# EAGLE design amelia_B_v1 (EAGLE 9.6.2)

## Sheet 1 of 3: Power
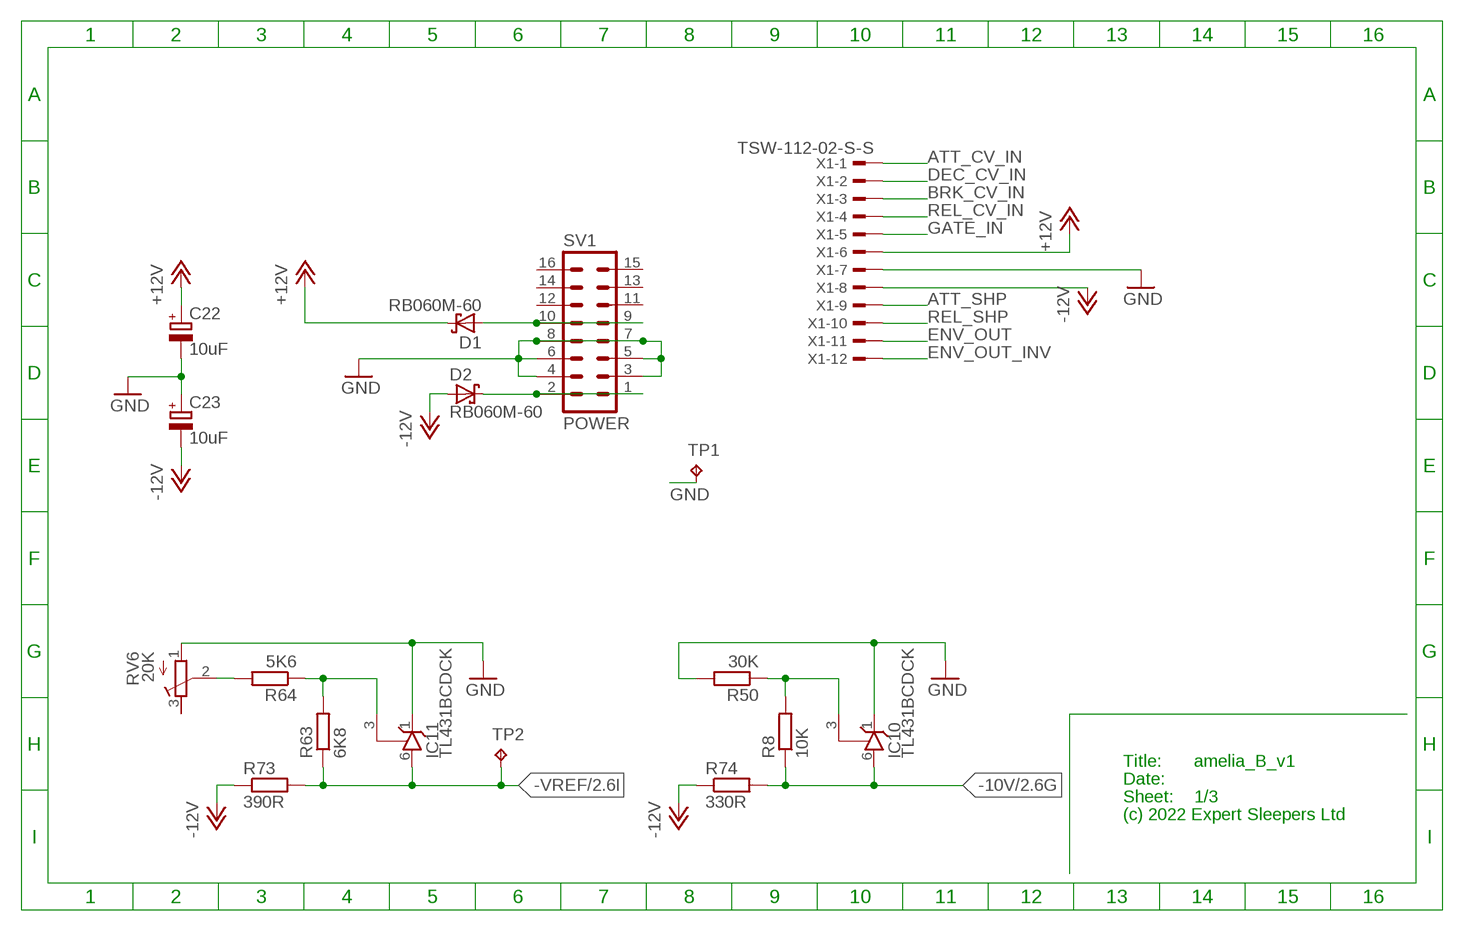
[diagram p0: schematic, sheet 1]

### Parts
C22  10uF  CPOL-EUUD-4X5,8  [UD-4X5,8_NICHICON]
C23  10uF  CPOL-EUUD-4X5,8  [UD-4X5,8_NICHICON]
D1  RB060M-60  [SOD123FL]
D2  RB060M-60  [SOD123FL]
IC10  TL431BCDCK  [DCK_SC-70]
IC11  TL431BCDCK  [DCK_SC-70]
R8  10K  R-EU_R0603  [R0603]
R50  30K  R-EU_R0603  [R0603]
R63  6K8  R-EU_R0603  [R0603]
R64  5K6  R-EU_R0603  [R0603]
R73  390R  R-EU_R1206  [R1206]
R74  330R  R-EU_R1206  [R1206]
RV6  20K  TC33X  [TC33X]
SV1  POWER  ML16  [ML16]
TP1  RA2  TPPAD1-13  [P1-13]
TP2  RA2  TPPAD1-13  [P1-13]
X1  TSW-112-02-S-S  [TSW-112-02-S-S]

### Nets
+12V: C22.+ D1.C X1.6 ; also sheet 2,3
-10V [power]: IC10.6(A) R8.1 R74.2 ; also sheet 2
-12V: C23.- D2.A R73.1 R74.1 X1.8 ; also sheet 2
-VREF: IC11.6(A) R63.1 R73.2 TP2.TP ; also sheet 2
ATT_CV_IN: X1.1 ; also sheet 2
ATT_SHP: X1.9 ; also sheet 2
BRK_CV_IN: X1.3 ; also sheet 2
DEC_CV_IN: X1.2 ; also sheet 2
ENV_OUT: X1.11 ; also sheet 2
ENV_OUT_INV: X1.12 ; also sheet 2
GATE_IN: X1.5 ; also sheet 3
GND [power]: C22.- C23.+ IC10.1(C) IC11.1(C) R50.2 RV6.1(A) SV1.3 SV1.4 SV1.5 SV1.6 SV1.7 SV1.8 TP1.TP X1.7 ; also sheet 2,3
N$1: D2.C SV1.1 SV1.2
N$15: D1.A SV1.9 SV1.10
N$20: IC11.3(R) R63.2 R64.1
N$21: R64.2 RV6.2(S)
N$28 [power]: IC10.3(R) R8.2 R50.1
REL_CV_IN: X1.4 ; also sheet 2
REL_SHP: X1.10 ; also sheet 2
Unconnected: RV6.3(E) SV1.11 SV1.12 SV1.13 SV1.14 SV1.15 SV1.16

### Notes on the sheet
- Title:
- Date:
- Sheet:
- (c) 2022 Expert Sleepers Ltd

## Sheet 2 of 3: CV processing and integrator
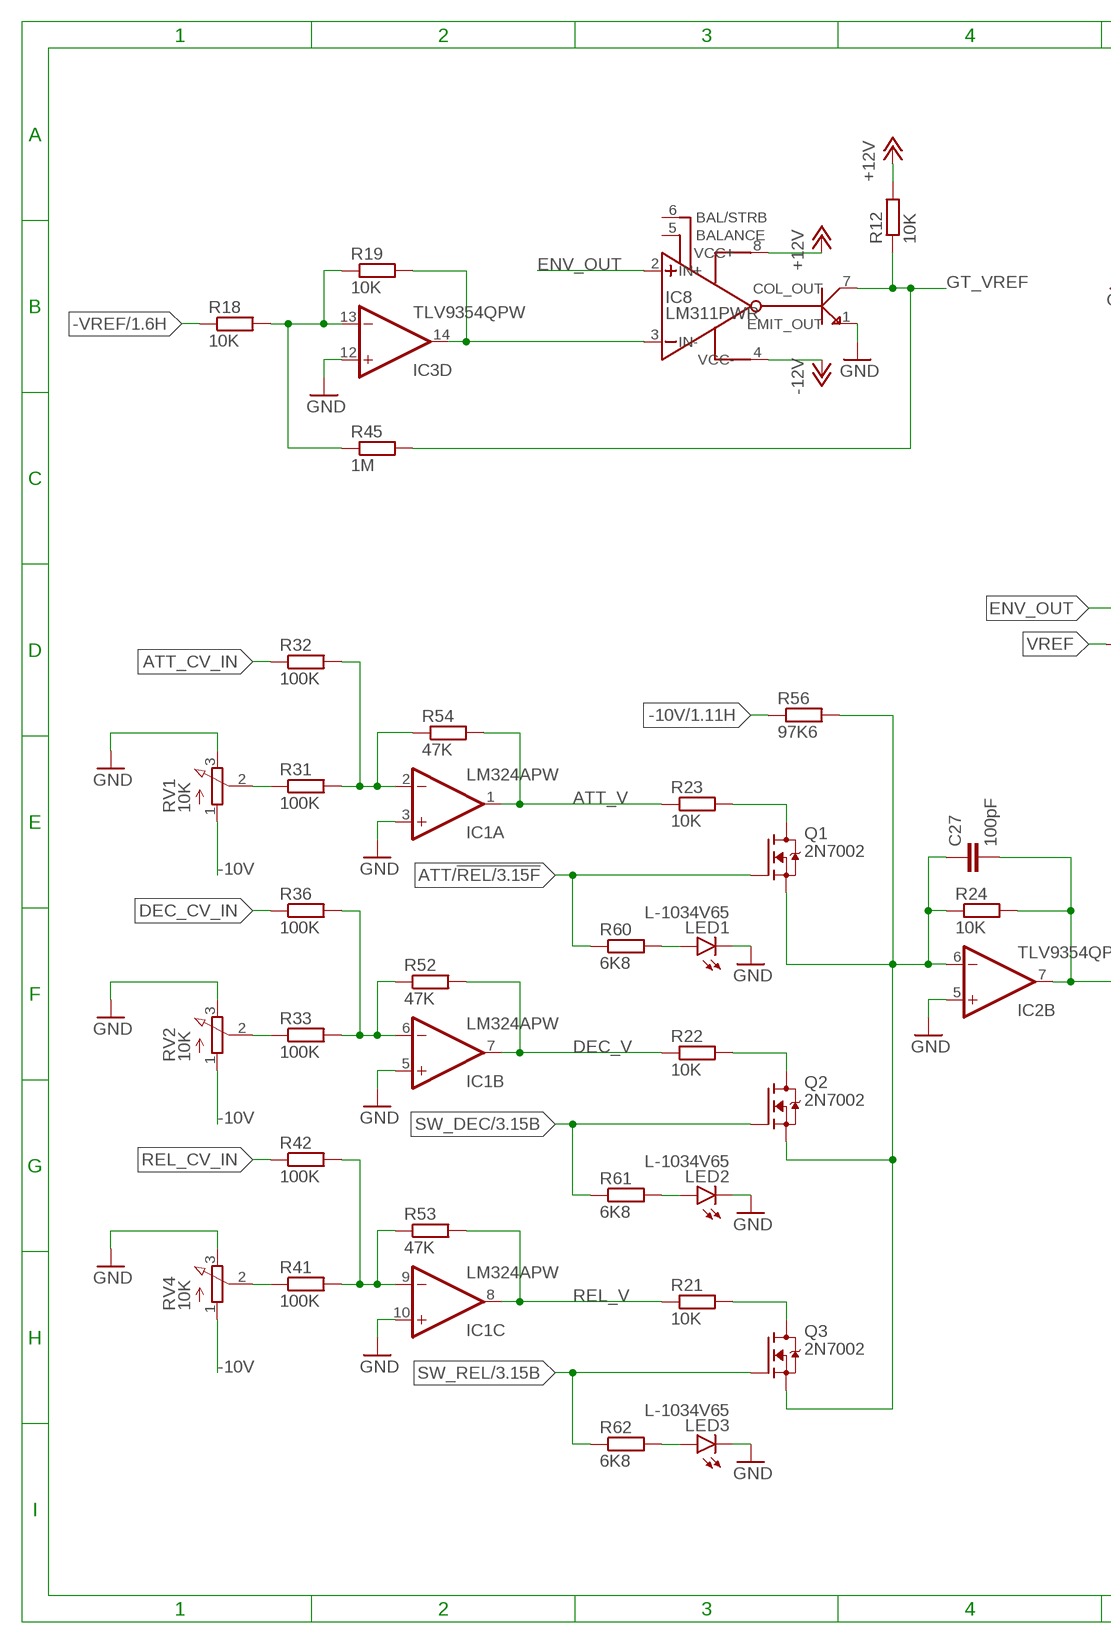
[diagram p1: schematic, sheet 2, part 1 of 2]
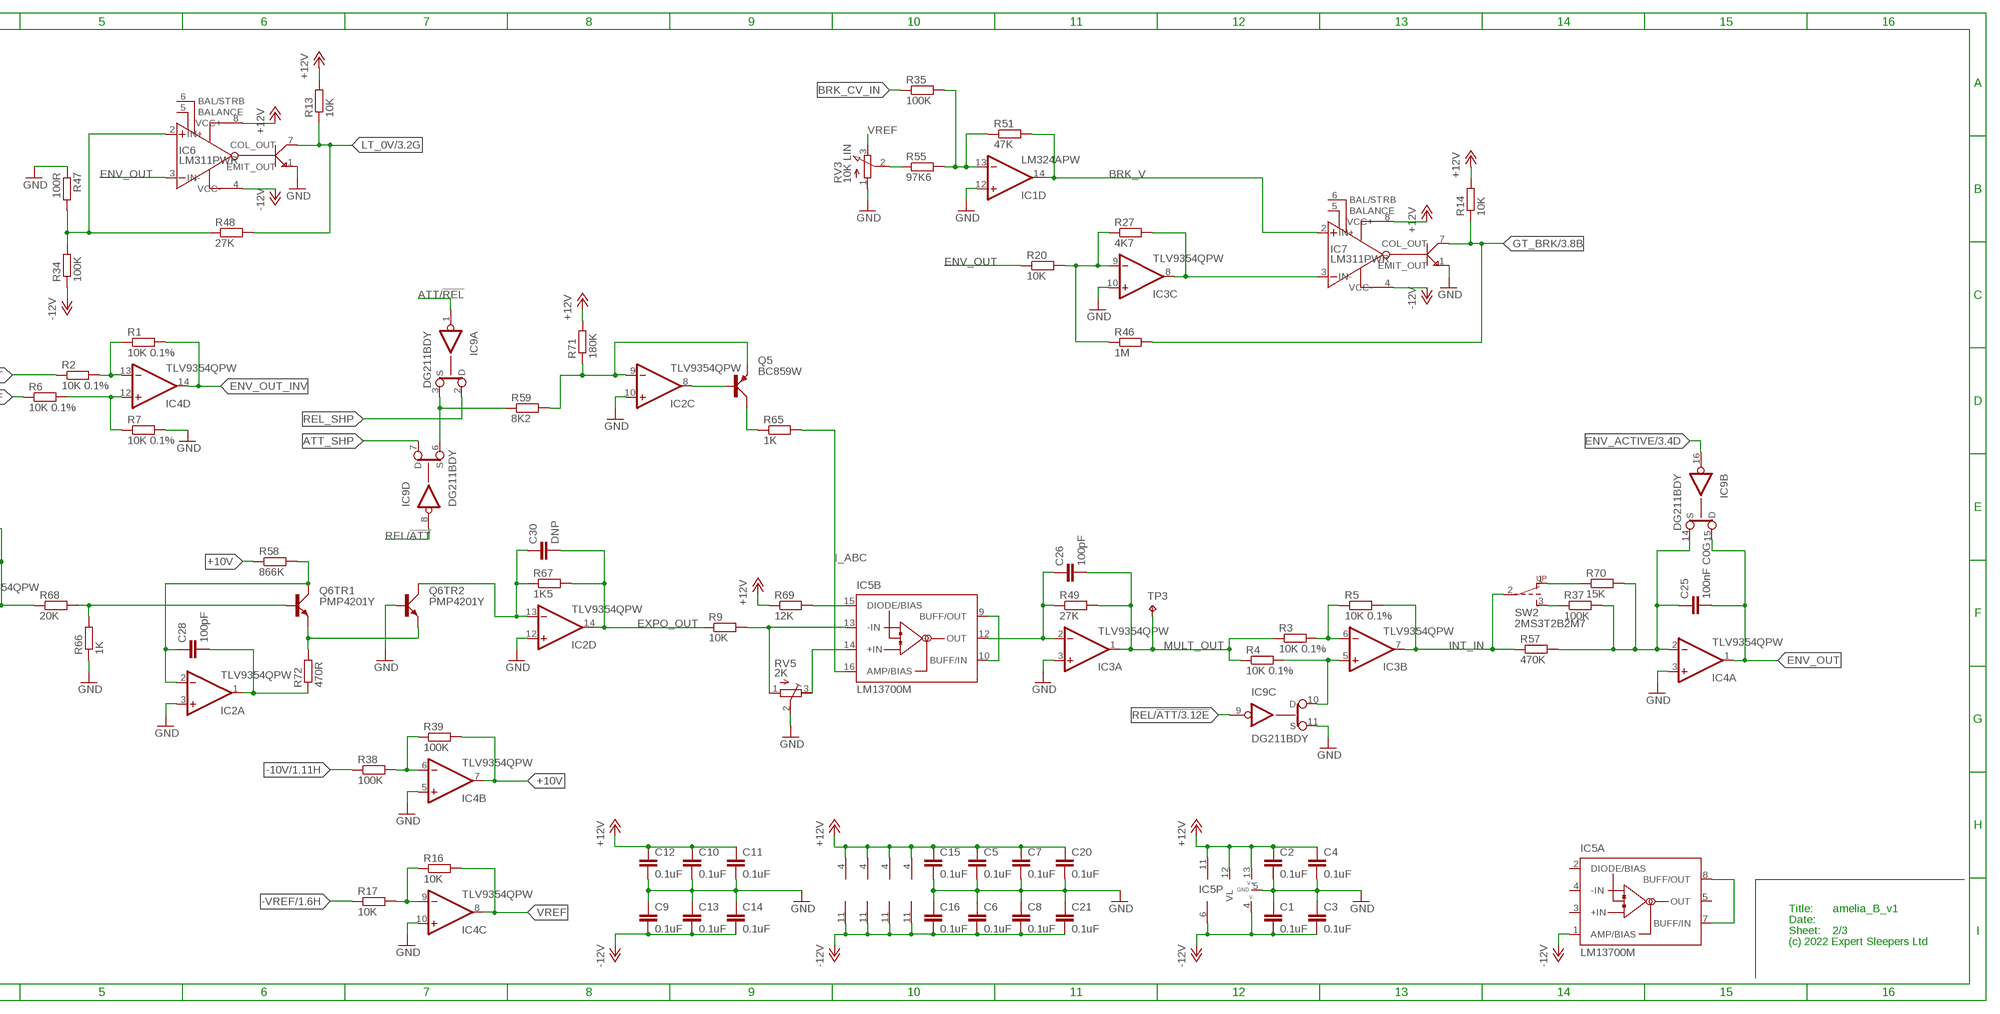
[diagram p2: schematic, sheet 2, part 2 of 2]

### Parts
C1  0.1uF  C-EUC0402  [C0402]
C2  0.1uF  C-EUC0402  [C0402]
C3  0.1uF  C-EUC0402  [C0402]
C4  0.1uF  C-EUC0402  [C0402]
C5  0.1uF  C-EUC0402  [C0402]
C6  0.1uF  C-EUC0402  [C0402]
C7  0.1uF  C-EUC0402  [C0402]
C8  0.1uF  C-EUC0402  [C0402]
C9  0.1uF  C-EUC0402  [C0402]
C10  0.1uF  C-EUC0402  [C0402]
C11  0.1uF  C-EUC0402  [C0402]
C12  0.1uF  C-EUC0402  [C0402]
C13  0.1uF  C-EUC0402  [C0402]
C14  0.1uF  C-EUC0402  [C0402]
C15  0.1uF  C-EUC0402  [C0402]
C16  0.1uF  C-EUC0402  [C0402]
C20  0.1uF  C-EUC0402  [C0402]
C21  0.1uF  C-EUC0402  [C0402]
C25  100nF C0G  C-EUC1206  [C1206]
C26  100pF  C-EUC0603  [C0603]
C27  100pF  C-EUC0603  [C0603]
C28  100pF  C-EUC0603  [C0603]
C30  DNP  C-EUC0603  [C0603]
IC1  LM324APW  TL074PW  [PW_R-PDSO-G14]
IC2  TLV9354QPW  TL074PW  [PW_R-PDSO-G14]
IC3  TLV9354QPW  TL074PW  [PW_R-PDSO-G14]
IC4  TLV9354QPW  TL074PW  [PW_R-PDSO-G14]
IC5  LM13700M  [SO16]
IC6  LM311PWR  [SOP65P640X120-8N]
IC7  LM311PWR  [SOP65P640X120-8N]
IC8  LM311PWR  [SOP65P640X120-8N]
IC9  DG211BDY  DG211CJD  [SO16]
LED1  L-1034V65  [L-1034_V6.5MM]
LED2  L-1034V65  [L-1034_V6.5MM]
LED3  L-1034V65  [L-1034_V6.5MM]
Q1  2N7002  [SOT23]
Q2  2N7002  [SOT23]
Q3  2N7002  [SOT23]
Q5  BC859W  [SOT323]
Q6  PMP4201Y  [SOT65P210X110-6N]
R1  10K 0.1%  R-EU_R0603  [R0603]
R2  10K 0.1%  R-EU_R0603  [R0603]
R3  10K 0.1%  R-EU_R0603  [R0603]
R4  10K 0.1%  R-EU_R0603  [R0603]
R5  10K 0.1%  R-EU_R0603  [R0603]
R6  10K 0.1%  R-EU_R0603  [R0603]
R7  10K 0.1%  R-EU_R0603  [R0603]
R9  10K  R-EU_R0603  [R0603]
R12  10K  R-EU_R0603  [R0603]
R13  10K  R-EU_R0603  [R0603]
R14  10K  R-EU_R0603  [R0603]
R16  10K  R-EU_R0603  [R0603]
R17  10K  R-EU_R0603  [R0603]
R18  10K  R-EU_R0603  [R0603]
R19  10K  R-EU_R0603  [R0603]
R20  10K  R-EU_R0603  [R0603]
R21  10K  R-EU_R0603  [R0603]
R22  10K  R-EU_R0603  [R0603]
R23  10K  R-EU_R0603  [R0603]
R24  10K  R-EU_R0603  [R0603]
R27  4K7  R-EU_R0603  [R0603]
R31  100K  R-EU_R0603  [R0603]
R32  100K  R-EU_R0603  [R0603]
R33  100K  R-EU_R0603  [R0603]
R34  100K  R-EU_R0603  [R0603]
R35  100K  R-EU_R0603  [R0603]
R36  100K  R-EU_R0603  [R0603]
R37  100K  R-EU_R0603  [R0603]
R38  100K  R-EU_R0603  [R0603]
R39  100K  R-EU_R0603  [R0603]
R41  100K  R-EU_R0603  [R0603]
R42  100K  R-EU_R0603  [R0603]
R45  1M  R-EU_R0603  [R0603]
R46  1M  R-EU_R0603  [R0603]
R47  100R  R-EU_R0603  [R0603]
R48  27K  R-EU_R0603  [R0603]
R49  27K  R-EU_R0603  [R0603]
R51  47K  R-EU_R0603  [R0603]
R52  47K  R-EU_R0603  [R0603]
R53  47K  R-EU_R0603  [R0603]
R54  47K  R-EU_R0603  [R0603]
R55  97K6  R-EU_R0603  [R0603]
R56  97K6  R-EU_R0603  [R0603]
R57  470K  R-EU_R0603  [R0603]
R58  866K  R-EU_R0603  [R0603]
R59  8K2  R-EU_R0603  [R0603]
R60  6K8  R-EU_R0603  [R0603]
R61  6K8  R-EU_R0603  [R0603]
R62  6K8  R-EU_R0603  [R0603]
R65  1K  R-EU_R0603  [R0603]
R66  1K  R-EU_R0603  [R0603]
R67  1K5  R-EU_R0603  [R0603]
R68  20K  R-EU_R0603  [R0603]
R69  12K  R-EU_R0603  [R0603]
R70  15K  R-EU_R0603  [R0603]
R71  180K  R-EU_R0603  [R0603]
R72  470R  R-EU_R0603  [R0603]
RV1  10K  RD1610NOA0X  [RD1610NOA0X]
RV2  10K  RD1610NOA0X  [RD1610NOA0X]
RV3  10K LIN  RD1610NOA0X  [RD1610NOA0X]
RV4  10K  RD1610NOA0X  [RD1610NOA0X]
RV5  2K  T93YA  [RTRIM3296W]
SW2  2MS3T2B2M7  [2MS1T2B2M7RE]
TP3  RA2  TPPAD1-13  [P1-13]

### Nets
+10V: IC4.7(B:OUT) R39.2 R58.1
+12V: C2.1 C4.1 C5.1 C7.1 C10.1 C11.1 C12.1 C15.1 C20.1 IC1.4(P:V+) IC2.4(P:V+) IC3.4(P:V+) IC4.4(P:V+) IC5.11(P:V+) IC6.8(VCC+) IC7.8(VCC+) IC8.8(VCC+) IC9.12(VL:VL) IC9.13(P:V+) R12.2 R13.2 R14.2 R69.1 R71.2 ; also sheet 1,3
-10V [power]: R38.1 R56.1 RV1.1(A) RV2.1(A) RV4.1(A) ; also sheet 1
-12V: C1.2 C3.2 C6.2 C8.2 C9.2 C13.2 C14.2 C16.2 C21.2 IC1.11(P:V-) IC2.11(P:V-) IC3.11(P:V-) IC4.11(P:V-) IC5.1(A:AMP/BIAS) IC5.6(P:V-) IC6.4(VCC-) IC7.4(VCC-) IC8.4(VCC-) IC9.4(P:V-) R34.1 ; also sheet 1
-VREF: R17.1 R18.1 ; also sheet 1
ATT/!REL: IC9.1(A:IN) Q1.1(G) R60.1 ; also sheet 3
ATT_CV_IN: R32.1 ; also sheet 1
ATT_SHP: IC9.7(D:D) ; also sheet 1
ATT_V: IC1.1(A:OUT) R23.1 R54.2
BRK_CV_IN: R35.1 ; also sheet 1
BRK_V: IC1.14(D:OUT) IC7.2(IN+) R51.2
DEC_CV_IN: R36.1 ; also sheet 1
DEC_V: IC1.7(B:OUT) R22.1 R52.2
ENV_ACTIVE: IC9.16(B:IN) ; also sheet 3
ENV_OUT: C25.2 IC4.1(A:OUT) IC6.3(IN-) IC8.2(IN+) IC9.15(B:D) R2.1 R20.1 ; also sheet 1
ENV_OUT_INV: IC4.14(D:OUT) R1.2 ; also sheet 1
EXPO_OUT: C30.2 IC2.14(D:OUT) R9.1 R67.2
GND [power]: C1.1 C2.2 C3.1 C4.2 C5.2 C6.1 C7.2 C8.1 C9.1 C10.2 C11.2 C12.2 C13.1 C14.1 C15.2 C16.1 C20.2 C21.1 IC1.3(A:+IN) IC1.5(B:+IN) IC1.10(C:+IN) IC1.12(D:+IN) IC2.3(A:+IN) IC2.5(B:+IN) IC2.10(C:+IN) IC2.12(D:+IN) IC3.3(A:+IN) IC3.10(C:+IN) IC3.12(D:+IN) IC4.3(A:+IN) IC4.5(B:+IN) IC4.10(C:+IN) IC6.1(EMIT_OUT) IC7.1(EMIT_OUT) IC8.1(EMIT_OUT) IC9.5(P:GND) IC9.11(C:S) LED1.K(C) LED2.K(C) LED3.K(C) Q6.2(TR2:B) R7.2 R47.1 R66.1 RV1.3(E) RV2.3(E) RV3.1(A) RV4.3(E) RV5.2(S) ; also sheet 1,3
GT_BRK: IC7.7(COL_OUT) R14.1 R46.2 ; also sheet 3
GT_VREF: IC8.7(COL_OUT) R12.1 R45.2 ; also sheet 3
I_ABC: IC5.16(B:AMP/BIAS) R65.2
INT_IN: IC3.7(B:OUT) R5.2 R57.1 SW2.2(PR)
LT_0V: IC6.7(COL_OUT) R13.1 R48.2 ; also sheet 3
MULT_OUT: C26.2 IC3.1(A:OUT) R3.1 R4.1 R49.2 TP3.TP
N$2: IC4.13(D:-IN) R1.1 R2.2
N$9: C30.1 IC2.13(D:-IN) Q6.3(TR2:C) R67.1
N$10: C26.1 IC3.2(A:-IN) IC5.12(B:OUT) R49.1
N$12: IC5.15(B:DIODE/BIAS) R69.2
N$13: IC3.6(B:-IN) R3.2 R5.1
N$14: IC5.13(B:-IN) R9.2 RV5.1(A)
N$16: IC5.7(A:BUFF/IN) IC5.8(A:BUFF/OUT)
N$23: IC3.13(D:-IN) R18.2 R19.1 R45.1
N$24: IC3.14(D:OUT) IC8.3(IN-) R19.2
N$26: R41.1 RV4.2(S)
N$32: IC1.9(C:-IN) R41.2 R42.2 R53.1
N$33: Q1.3(D) R23.2
N$34: C27.2 IC2.7(B:OUT) R24.2 R68.1
N$35: R55.1 RV3.2(S)
N$37: IC4.9(C:-IN) R16.1 R17.2
N$41: IC4.12(D:+IN) R6.2 R7.1
N$42: IC3.9(C:-IN) R20.2 R27.1 R46.1
N$43: IC6.2(IN+) R34.2 R47.2 R48.1
N$44: IC3.8(C:OUT) IC7.3(IN-) R27.2
N$45: C25.1 IC4.2(A:-IN) IC9.14(B:S) R37.2 R57.2 R70.2
N$46: IC2.8(C:OUT) Q5.1(B)
N$48: IC3.5(B:+IN) IC9.10(C:D) R4.2
N$49: R31.1 RV1.2(S)
N$50: Q2.3(D) R22.2
N$51: IC1.13(D:-IN) R35.2 R51.1 R55.2
N$52: Q3.3(D) R21.2
N$53: C27.1 IC2.6(B:-IN) Q1.2(S) Q2.2(S) Q3.2(S) R24.1 R56.2
N$54: Q6.1(TR1:B) R66.2 R68.2
N$55: IC5.14(B:+IN) RV5.3(E)
N$56: IC1.2(A:-IN) R31.2 R32.2 R54.1
N$57: R33.1 RV2.2(S)
N$58: IC1.6(B:-IN) R33.2 R36.2 R52.1
N$59: R37.1 SW2.3(RD)
N$60: C28.1 IC2.2(A:-IN) Q6.6(TR1:C) R58.2
N$61: C28.2 IC2.1(A:OUT) R72.1
N$62: IC2.9(C:-IN) Q5.2(E) R59.2 R71.1
N$63: R70.1 SW2.1(RU)
N$64: Q6.4(TR2:E) Q6.5(TR1:E) R72.2
N$69: IC4.6(B:-IN) R38.2 R39.1
N$73: LED1.A R60.2
N$75: LED2.A R61.2
N$78: LED3.A R62.2
N$79: Q5.3(C) R65.1
N$80: IC9.3(A:S) IC9.6(D:S) R59.1
N$83: IC5.9(B:BUFF/OUT) IC5.10(B:BUFF/IN)
REL/!ATT: IC9.8(D:IN) IC9.9(C:IN) ; also sheet 3
REL_CV_IN: R42.1 ; also sheet 1
REL_SHP: IC9.2(A:D) ; also sheet 1
REL_V: IC1.8(C:OUT) R21.1 R53.2
SW_DEC: Q2.1(G) R61.1 ; also sheet 3
SW_REL: Q3.1(G) R62.1 ; also sheet 3
VREF: IC4.8(C:OUT) R6.1 R16.2 RV3.3(E)
Unconnected: IC5.2(A:DIODE/BIAS) IC5.3(A:+IN) IC5.4(A:-IN) IC5.5(A:OUT) IC6.5(BALANCE) IC6.6(BAL/STRB) IC7.5(BALANCE) IC7.6(BAL/STRB) IC8.5(BALANCE) IC8.6(BAL/STRB)

### Notes on the sheet
- Title:
- Date:
- Sheet:
- (c) 2022 Expert Sleepers Ltd

## Sheet 3 of 3: Logic
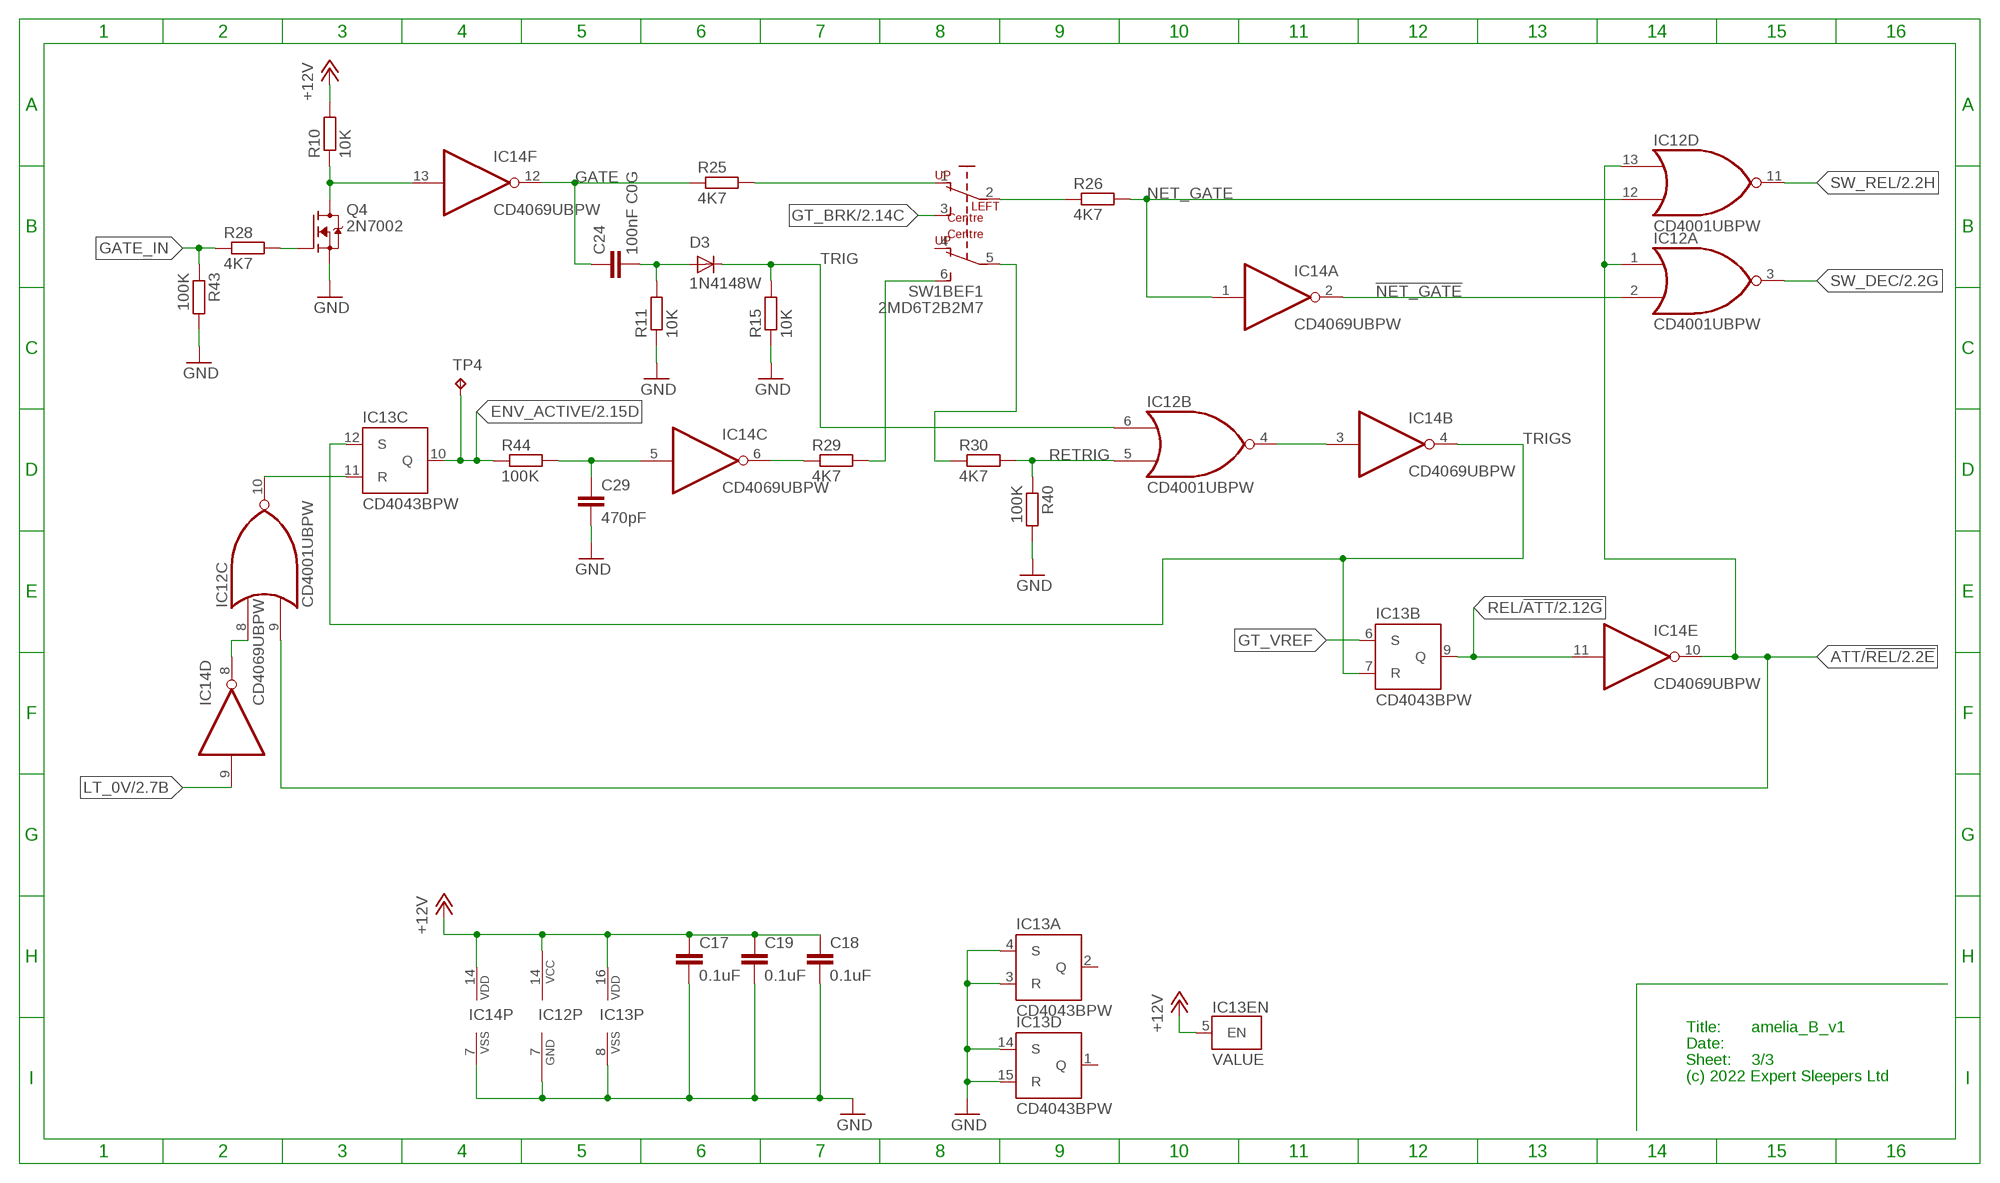
[diagram p3: schematic, sheet 3]

### Parts
C17  0.1uF  C-EUC0402  [C0402]
C18  0.1uF  C-EUC0402  [C0402]
C19  0.1uF  C-EUC0402  [C0402]
C24  100nF C0G  C-EUC1206  [C1206]
C29  470pF  C-EUC0603  [C0603]
D3  1N4148W  [SOD123]
IC12  CD4001UBPW  [TSSOP14]
IC13  CD4043BPW  [TSSOP16]
IC14  CD4069UBPW  [TSSOP14]
Q4  2N7002  [SOT23]
R10  10K  R-EU_R0603  [R0603]
R11  10K  R-EU_R0603  [R0603]
R15  10K  R-EU_R0603  [R0603]
R25  4K7  R-EU_R0603  [R0603]
R26  4K7  R-EU_R0603  [R0603]
R28  4K7  R-EU_R0603  [R0603]
R29  4K7  R-EU_R0603  [R0603]
R30  4K7  R-EU_R0603  [R0603]
R40  100K  R-EU_R0603  [R0603]
R43  100K  R-EU_R0603  [R0603]
R44  100K  R-EU_R0603  [R0603]
SW1  2MD6T2B2M7  [2MD1T2B2M7RE]
TP4  RA2  TPPAD1-13  [P1-13]

### Nets
!NET_GATE: IC12.2(A:I1) IC14.2(A:O)
+12V: C17.1 C18.1 C19.1 IC12.14(P:VCC) IC13.5(EN:EN) IC13.16(P:VDD) IC14.14(P:VDD) R10.2 ; also sheet 1,2
ATT/!REL: IC12.1(A:I0) IC12.9(C:I1) IC12.13(D:I0) IC14.10(E:O) ; also sheet 2
ENV_ACTIVE: IC13.10(C:Q) R44.1 TP4.TP ; also sheet 2
GATE: C24.1 IC14.12(F:O) R25.1
GATE_IN: R28.1 R43.1 ; also sheet 1
GATE_SW: R25.2 SW1.1(BEF1:LU)
GND [power]: C17.2 C18.2 C19.2 C29.2 IC12.7(P:GND) IC13.3(A:R) IC13.4(A:S) IC13.8(P:VSS) IC13.14(D:S) IC13.15(D:R) IC14.7(P:VSS) Q4.2(S) R11.1 R15.1 R40.2 R43.2 ; also sheet 1,2
GT_BRK: SW1.3(BEF1:LD) ; also sheet 2
GT_VREF: IC13.6(B:S) ; also sheet 2
LT_0V: IC14.9(D:I) ; also sheet 2
N$18: C29.1 IC14.5(C:I) R44.2
N$27: IC14.6(C:O) R29.1
N$31: IC12.8(C:I0) IC14.8(D:O)
N$36: IC12.4(B:O) IC14.3(B:I)
N$38: C24.2 D3.A R11.2
N$39: IC14.13(F:I) Q4.3(D) R10.1
N$40: Q4.1(G) R28.2
N$67: R26.1 SW1.2(BEF1:PL)
N$70: R29.2 SW1.6(BEF1:RD)
N$77: IC12.10(C:O) IC13.11(C:R)
NET_GATE: IC12.12(D:I1) IC14.1(A:I) R26.2
REL/!ATT: IC13.9(B:Q) IC14.11(E:I) ; also sheet 2
RETRIG: IC12.5(B:I1) R30.2 R40.1
RETRIG_SW: R30.1 SW1.5(BEF1:PR)
SW_DEC: IC12.3(A:O) ; also sheet 2
SW_REL: IC12.11(D:O) ; also sheet 2
TRIG: D3.C IC12.6(B:I0) R15.2
TRIGS: IC13.7(B:R) IC13.12(C:S) IC14.4(B:O)
Unconnected: IC13.1(D:Q) IC13.2(A:Q) SW1.4(BEF1:RU)

### Notes on the sheet
- Title:
- Date:
- Sheet:
- (c) 2022 Expert Sleepers Ltd

## Library data of the parts
C1-C21 C24-C30 = rcl:C-EU: CAPACITOR, European symbol
C22 C23 = rcl:CPOL-EU: POLARIZED CAPACITOR, European symbol
D1 D2 = rohm2:RB060M-60: Schottky Barrier Diode
D3 = diodes:1N4148W
IC1-IC4 = digital-audio:TL074: OP AMP
IC5 = texas:LM13700: Dual Operational Transconductance Amplifiers with Linearizing Diodes and Buffers Source: lm13700.PDF
IC6-IC8 = SamacSys_Parts:LM311PWR: High Speed, 30V, Differential Comparator With Strobes Source: Datasheet <http://www.ti.com/lit/ds/symlink/lm311.pdf>; ARROW_PART_NUMBER: LM311PWR; ARROW_PRICE-STOCK: https://www.arrow.com/en/products/lm311pwr/texas-instruments; DESCRIPTION: High Speed, 30V, Differential Comparator With Strobes; HEIGHT: 1.2mm; MANUFACTURER_NAME: Texas Instruments; MANUFACTURER_PART_NUMBER: LM311PWR; MOUSER_PART_NUMBER: 595-LM311PWR; MOUSER_PRICE-STOCK: https://www.mouser.co.uk/ProductDetail/Texas-Instruments/LM311PWR/?qs=YEaxc5757jOQ2Epklu87Vw%3D%3D
IC9 = linear:DG211CJ: CMOS SWITCH
IC10 IC11 = texas:TL431*
IC12 = logic:CD4001UB: Quad 2-input NOR gate
IC13 = logic:CD4043B: Quad 3-state NOR R/S LATCH
IC14 = logic:CD4069UB: Hex INVERTER
LED1-LED3 = leds:L-1034
Q1-Q4 = digital-audio:2N7002: 2N7002 N-channel MOSFET
Q5 = NXP:BC859W
Q6 = SamacSys_Parts:PMP4201Y: Bipolar Transistors - BJT MATCHED PAIR Source: Datasheet <https://componentsearchengine.com/Datasheets/1/PMP4201Y,135.pdf>; ARROW_PART_NUMBER: PMP4201Y,135; ARROW_PRICE-STOCK: https://www.arrow.com/en/products/pmp4201y135/nexperia; DESCRIPTION: Bipolar Transistors - BJT MATCHED PAIR; HEIGHT: 1.1mm; MANUFACTURER_NAME: Nexperia; MANUFACTURER_PART_NUMBER: PMP4201Y,135; MOUSER_PART_NUMBER: 771-PMP4201Y135; MOUSER_PRICE-STOCK: https://www.mouser.co.uk/ProductDetail/Nexperia/PMP4201Y135?qs=LOCUfHb8d9uqwNS3d98RHQ%3D%3D
R1-R74 = rcl:R-EU_: RESISTOR, European symbol
RV1-RV4 = soundwell:RD1610NOA0X: 16mm Potentiometer one level Source: http://www.alphapotentiometers.net/html/16mm_pot_2.html
RV5 = vishay:T93YA
RV6 = bourns:TC33X
SV1 = digital-audio:ML16: MULTICOMP - MC9A12-1634
SW1 = switch-multicomp:2MD6*: TINY SWITCH ON - ON Source: http://www2.produktinfo.conrad.com/datenblaetter/700000-724999/705152-da-01-de-Subminiaturschalter_TL_36WO.pdf
SW2 = switch-multicomp:2MS3*M7
TP1-TP4 = testpad:TP: Test pad
X1 = con-samtec:TSW-112-02-S-S: THROUGH-HOLE .025" SQ POST HEADER Source: Samtec TSW.pdf; OC_FARNELL: unknown; OC_NEWARK: unknown

## Net classes
0 default: width 0.203 mm

## Board
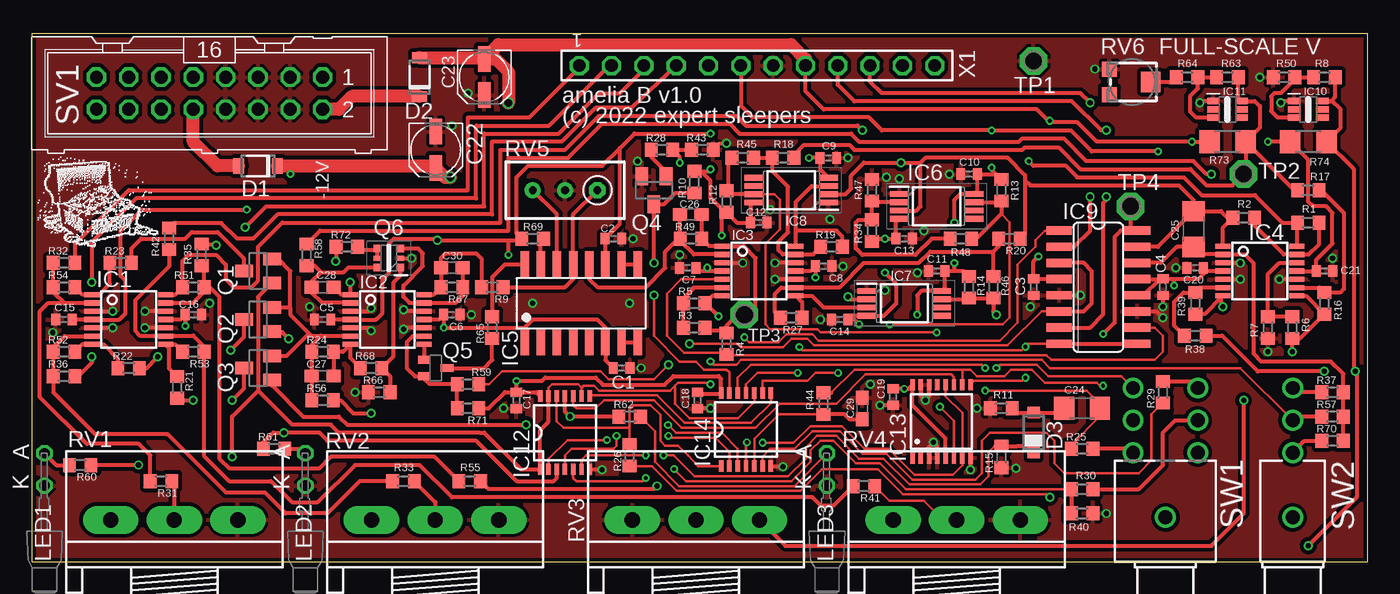
[diagram p4: board, top side]
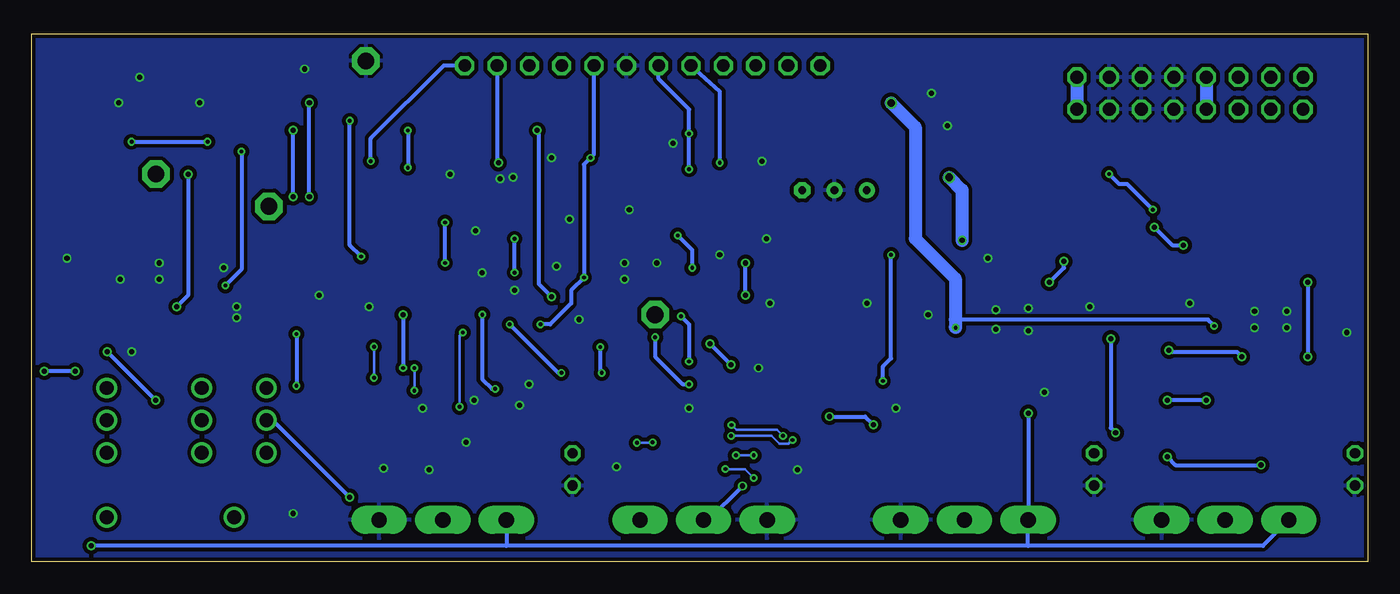
[diagram p5: board, bottom side, seen from below]

Size 105 x 41.5 mm. Coordinates in mm from the lower left corner, seen from the top.
Outline: 0,0 105,0 105,41.5 0,41.5 0,0
Copper layers (1*16): Top 0.035mm / dielectric 1.5mm / Bottom 0.035mm
Design rules "pcbtrain *": minimum track width 0.125mm, minimum drill 0.3mm, track to track 0.125mm, track to pad 0.125mm, pad to pad 0.125mm, via to via 0.125mm, smd to smd 0.125mm, copper to edge 0.25mm, drill to drill 8mil, minimum pad ring 0.15mm, minimum via ring 0.15mm, stop-mask expansion 4mil, vias tented up to drill 0mil, thermal gap 10mil

### Footprints (pad centres in the part's own frame; a part is rotated, then mirrored left to right if it is on the bottom)
C0402 = smd 0.7 x 0.9: 1 -0.65,0; 2 0.65,0
UD-4X5,8_NICHICON = smd 2 x 1: + 1.425,0; - -1.425,0
C1206 = smd 1.6 x 1.8: 1 -1.4,0; 2 1.4,0
C0603 = smd 1.1 x 1: 1 -0.85,0; 2 0.85,0
SOD123FL = smd 0.85 x 1.2: A 1.525,0; C -1.525,0
SOD123 = smd 0.9 x 0.95: A 1.575,0; C -1.575,0
PW_R-PDSO-G14 = smd 0.4 x 1.2: 1 -1.95,-2.9; 2 -1.3,-2.9; 3 -0.65,-2.9; 4 0,-2.9; 5 0.65,-2.9; 6 1.3,-2.9; 7 1.95,-2.9; 8 1.95,2.9; 9 1.3,2.9; 10 0.65,2.9; 11 0,2.9; 12 -0.65,2.9; 13 -1.3,2.9; 14 -1.95,2.9
SO16 = smd 0.66 x 2.032: 1 -4.445,-3.073; 2 -3.175,-3.073; 3 -1.905,-3.073; 4 -0.635,-3.073; 5 0.635,-3.073; 6 1.905,-3.073; 7 3.175,-3.073; 8 4.445,-3.073; 9 4.445,3.073; 10 3.175,3.073; 11 1.905,3.073; 12 0.635,3.073; 13 -0.635,3.073; 14 -1.905,3.073; 15 -3.175,3.073; 16 -4.445,3.073
SOP65P640X120-8N = smd 1.475 x 0.45: 1 -2.938,0.975; 2 -2.938,0.325; 3 -2.938,-0.325; 4 -2.938,-0.975; 5 2.938,-0.975; 6 2.938,-0.325; 7 2.938,0.325; 8 2.938,0.975
DCK_SC-70 = smd 1 x 0.5: 1 -1.1,0.65; 2 -1.1,0; 3 -1.1,-0.65; 4 1.1,-0.65; 5 1.1,0; 6 1.1,0.65
TSSOP14 = smd 0.9 x 0.35: 1 -2.875,1.95; 2 -2.875,1.3; 3 -2.875,0.65; 4 -2.875,0; 5 -2.875,-0.65; 6 -2.875,-1.3; 7 -2.875,-1.95; 8 2.875,-1.95; 9 2.875,-1.3; 10 2.875,-0.65; 11 2.875,0; 12 2.875,0.65; 13 2.875,1.3; 14 2.875,1.95
TSSOP16 = smd 0.9 x 0.35: 1 -2.875,2.275; 2 -2.875,1.625; 3 -2.875,0.975; 4 -2.875,0.325; 5 -2.875,-0.325; 6 -2.875,-0.975; 7 -2.875,-1.625; 8 -2.875,-2.275; 9 2.875,-2.275; 10 2.875,-1.625; 11 2.875,-0.975; 12 2.875,-0.325; 13 2.875,0.325; 14 2.875,0.975; 15 2.875,1.625; 16 2.875,2.275
L-1034_V6.5MM = drill 0.813 pad 1.27 octagon: A 9.04,0; K 6.5,0
SOT23 = smd 1 x 1.4: 1 -0.95,-1.1; 2 0.95,-1.1; 3 0,1.1
SOT323 = smd 0.6 x 1: 1 -0.65,-0.9; 2 0.65,-0.9; 3 0,0.9
SOT65P210X110-6N = smd 0.6 x 0.6: 1 -0.9,0.75; 3 -0.9,-0.75; 4 0.9,-0.75; 6 0.9,0.75 | smd 0.6 x 0.4: 2 -0.9,0; 5 0.9,0
R0603 = smd 1 x 1.1: 1 -0.85,0; 2 0.85,0
R1206 = smd 1.6 x 1.803: 1 -1.422,0; 2 1.422,0
RD1610NOA0X = drill 1.2 pad 2.184 long: 1 -5,3.8; 2 0,3.8; 3 5,3.8
RTRIM3296W = drill 0.61 pad 1.27 octagon: 1 0,-2.54 | drill 0.61 pad 1.27: 2 0,0; 3 0,2.54
TC33X = smd 1.2 x 1.2: 1 -1,-1.8; 3 1,-1.8 | smd 1.6 x 1.5: 2 0,1.45
ML16 = drill 1.016 octagon: 1 -8.89,-1.27; 2 -8.89,1.27; 3 -6.35,-1.27; 4 -6.35,1.27; 5 -3.81,-1.27; 6 -3.81,1.27; 7 -1.27,-1.27; 8 -1.27,1.27; 9 1.27,-1.27; 10 1.27,1.27; 11 3.81,-1.27; 12 3.81,1.27; 13 6.35,-1.27; 14 6.35,1.27; 15 8.89,-1.27; 16 8.89,1.27
2MD1T2B2M7RE = drill 1.092: 1 -2.54,5.08; 2 -2.54,7.62; 3 -2.54,10.16; 4 2.54,5.08; 5 2.54,7.62; 6 2.54,10.16; 7 0,0
2MS1T2B2M7RE = drill 1.092: 1 0,5.08; 2 0,7.62; 3 0,10.16; 7 0,0
P1-13 = drill 1.321 pad 2.159 octagon: TP 0,0
TSW-112-02-S-S = drill 1 pad 1.5 octagon: 1 13.97,0; 2 11.43,0; 3 8.89,0; 4 6.35,0; 5 3.81,0; 6 1.27,0; 7 -1.27,0; 8 -3.81,0; 9 -6.35,0; 10 -8.89,0; 11 -11.43,0; 12 -13.97,0

### Placement (x,y rotation side)
C1  46.35,15.24 180 top
C2  45.72,25.4 0 top
C3  78.74,21.59 90 top
C4  88.9,21.59 270 top
C5  22.86,19.05 180 top
C6  33.02,19.43 180 top
C7  51.56,23.11 180 top
C8  62.23,23.24 180 top
C9  62.61,31.75 180 top
C10  73.66,30.48 180 top
C11  71.12,22.86 180 top
C12  57.15,26.67 0 top
C13  68.58,25.4 180 top
C14  63.5,19.05 0 top
C15  2.54,19.05 180 top
C16  12.7,19.43 180 top
C17  38.1,12.7 270 top
C18  52.32,12.7 270 top
C19  67.69,12.95 270 top
C20  91.44,23.11 180 top
C21  101.6,22.86 180 top
C22  31.75,32.38 270 top
C23  35.56,38.1 270 top
C24  82.55,12.06 180 top
C25  91.31,26.16 90 top
C26  51.8,27.3 0 top
C27  22.86,14.61 0 top
C28  22.86,21.59 0 top
C29  65.28,12.06 90 top
C30  33.02,23.11 180 top
D1  17.78,31.11 180 top
D2  30.48,38.1 90 top
D3  78.74,10.16 90 top
IC1  7.62,19.05 270 top
IC2  27.94,19.05 270 top
IC3  57.15,22.86 270 top
IC4  96.52,22.86 270 top
IC5  43.18,20.32 0 top
IC6  71.12,27.94 0 top
IC7  68.58,20.32 0 top
IC8  59.69,29.21 180 top
IC9  83.82,21.59 270 top
IC10  100.33,35.56 0 top
IC11  93.98,35.56 0 top
IC12  41.91,10.16 90 top
IC13  71.5,11.05 90 top
IC14  56.13,10.41 90 top
LED1  1,-0.5 90 top
LED2  21.5,-0.5 90 top
LED3  62.5,-0.5 90 top
Q1  17.78,22.86 90 top
Q2  17.78,19.05 90 top
Q3  17.78,15.24 90 top
Q4  48.9,29.21 180 top
Q5  31.75,15.24 270 top
Q6  28.07,23.88 180 top
R1  100.33,26.67 180 top
R2  95.25,27.05 0 top
R3  52.07,18.41 180 top
R4  54.61,17.14 270 top
R5  52.07,20.32 0 top
R6  99.06,18.41 90 top
R7  97.16,18.41 270 top
R8  101.6,38.1 180 top
R9  36.2,21.59 0 top
R10  52.07,29.84 90 top
R11  76.2,12.06 0 top
R12  54.61,28.32 270 top
R13  76.2,29.21 90 top
R14  73.66,21.59 90 top
R15  76.2,8.26 90 top
R16  101.6,20.32 270 top
R17  100.33,29.21 0 top
R18  59.05,31.75 180 top
R19  62.87,24.77 0 top
R20  76.83,25.4 180 top
R21  11.43,13.72 270 top
R22  7.62,15.24 0 top
R23  6.99,23.5 0 top
R24  22.86,16.51 0 top
R25  82.55,8.89 0 top
R26  46.99,8.38 90 top
R27  59.69,19.18 0 top
R28  49.53,32.38 180 top
R29  88.9,13.34 90 top
R30  82.55,5.71 180 top
R31  10.16,6.35 180 top
R32  2.54,23.5 180 top
R33  29.21,6.35 180 top
R34  66.04,26.04 90 top
R35  13.34,24.13 270 top
R36  2.54,14.61 180 top
R37  102.23,13.34 0 top
R38  91.44,17.78 180 top
R39  91.44,20.32 270 top
R40  82.55,3.81 0 top
R41  65.41,5.97 180 top
R42  10.79,25.4 270 top
R43  52.7,32.38 0 top
R44  62.23,12.45 270 top
R45  55.88,31.75 180 top
R46  75.56,21.59 270 top
R47  66.04,29.21 270 top
R48  73.03,25.4 0 top
R49  51.82,25.4 0 top
R50  98.42,38.1 180 top
R51  12.7,21.59 180 top
R52  2.54,16.51 0 top
R53  12.7,16.51 180 top
R54  2.54,21.59 0 top
R55  34.42,6.35 180 top
R56  22.86,12.7 180 top
R57  102.23,11.43 0 top
R58  21.59,24.13 270 top
R59  34.29,13.97 180 top
R60  3.81,7.62 180 top
R61  19.05,8.89 0 top
R62  46.99,11.43 0 top
R63  93.98,38.1 180 top
R64  90.81,38.1 180 top
R65  36.2,18.41 90 top
R66  27.3,13.34 0 top
R67  33.02,21.59 180 top
R68  26.67,15.24 0 top
R69  39.37,25.4 0 top
R70  102.23,9.53 0 top
R71  34.29,12.06 0 top
R72  24.77,24.77 0 top
R73  93.98,33.02 0 top
R74  100.33,33.02 0 top
RV1  11.2,-0.5 0 top
RV2  31.7,-0.5 0 top
RV3  52.2,-0.5 0 top
RV4  72.7,-0.5 0 top
RV5  41.91,29.21 90 top
RV6  86.49,37.72 270 top
SV1  13.97,36.83 180 top
SW1  89.1,3.51 0 top
SW2  99.1,3.51 0 top
TP1  78.74,39.37 180 top
TP2  95.25,30.48 0 top
TP3  56.01,19.43 0 top
TP4  86.36,27.94 0 top
U$2  [TREASURE_10MM_300DPI]  0.08,24.68 0 top
X1  57,39 180 top

### Tracks (layer width: path | path; a pad name or v marks a point on that pad's centre or on a via)
!NET_GATE  (via drill 0.3)
  Top 0.203: IC14.2 54.83,8.67 53.72,9.78 50.16,9.78 v50.04,9.91 | v45.2,9.58 42.09,9.58 40.61,8.1 IC12.2
  Bottom 0.203: v45.2,9.58 45.51,9.27 46.23,9.27 46.86,9.91 v50.04,9.91
+10V  (via drill 0.4)
  Top 0.305: IC4.7 93.5,20.8 | 93.5,20.8 92.18,19.47 R39.2 | R58.1 22.64,26.04 37.47,26.04 37.47,31.75 42.16,31.75 44.83,34.42 54.86,34.42 55.63,33.66 64.39,33.66 65.02,33.02 77.6,33.02 77.85,33.27 81.13,33.27 82.9,31.5 91.31,31.5 92.33,30.47 v92.71,30.47 | v93.6,20.07 93.5,20.16 93.5,20.8
  Bottom 0.305: v92.71,30.47 92.71,20.95 v93.6,20.07
+12V  (via drill 0.3, 0.4, 0.6)
  Top 0.305: C15.1 IC1.4 6.86,19.05 7.37,19.56 7.37,22.1 6.99,22.48 6.99,26.04 8.64,27.69 v16.89,27.69 | C5.1 IC2.4 27.05,19.05 27.56,19.56 27.56,22.23 28.07,22.73 28.07,25.02 28.45,25.4 31.75,25.4 v31.88,25.27 37.47,25.27 | IC5.11 45.09,25.39 C2.1 46.23,26.56 46.23,32.51 | IC3.4 53.34,22.86 | 53.34,22.86 52.47,22.86 C7.1 | IC9.13 88.65,22.23 | 88.65,22.23 88.89,22.23 C4.1 89.79,22.24 | IC9.12 87.38,20.95 88.65,22.23 | IC4.4 92.34,22.86 C20.1 92.09,22.62 91.71,22.24 89.79,22.24 | IC8.8 56.5,27.98 C12.1 55.41,26.67 R12.2 | R14.2 73.24,22.86 72.39,22.86 | 72.39,22.86 C11.1 71.77,21.55 IC7.8 69.94,21.3 69.6,20.95 v69.6,19.43 | C19.1 v68.58,13.6 68.91,13.6 IC13.16 69.23,12.31 71.83,9.71 IC13.5 | C17.1 39.65,13.35 IC12.14 | 72.39,22.86 72.52,22.99 v72.52,23.5 | v72.52,26.67 72.52,28.45 72.98,28.91 IC6.8 74.31,29.17 C10.1 75.78,30.48 R13.2 75.44,30.82 v75.44,30.99 | v89.79,21.72 89.79,22.24 | v88.52,32.26 83.31,32.26 81.66,33.91 v75.44,33.91 66.8,33.91 65.79,34.92 56.64,34.92 55.73,35.84 X1.6 | R12.2 54.48,27.47 53.34,28.61 53.34,29.97 52.62,30.7 R10.2 53.17,30.7 v53.34,30.86 | 53.34,22.86 v53.09,23.11 | v54.23,25.65 54.23,27.09 R12.2 | 46.23,32.51 47.37,33.66 v53.34,33.66 | 46.23,32.51 44.83,31.11 38.99,31.11 38.1,30.23 38.1,25.82 R69.1 38.39,25.27 37.47,25.27 | v20.32,30.48 20.32,31.11 | C17.1 v38.1,14.22 40.1,14.22 40.36,14.48 44.32,14.48 44.88,13.92 49.73,13.92 50.42,14.61 53.98,14.61 54.18,14.4 IC14.14 54.06,13.16 52.51,13.16 C18.1 | v37.47,24.13 37.47,25.27 | R71.2 35.9,12.06 37.19,13.35 C17.1
  Top 1.016: D1.C 20.32,31.11 31.59,31.11 C22.+ 32.48,30.23 v32.89,30.23
  Bottom 0.305: v72.52,23.5 v72.52,26.67 | v69.6,19.43 69.6,14.37 68.83,13.6 v68.58,13.6 | v75.44,33.91 v75.44,30.99 | v88.52,32.26 88.52,22.99 v89.79,21.72 | v53.34,30.86 v53.34,33.66 53.34,35.56 55.73,37.95 X1.6 | v53.09,23.11 53.09,24.51 v54.23,25.65 | v16.89,27.69 18.92,29.72 19.56,29.72 v20.32,30.48 | v38.1,14.22 38.1,15.37 37.47,16 v37.47,24.13
  Bottom 1.016: v32.89,30.23 31.88,29.21 v31.88,25.27
-10V  (via drill 0.4)
  Top 0.305: IC10.6 102.12,36.21 102.17,36.26 | R8.1 102.45,36.54 102.17,36.26 | 102.17,36.26 102.87,35.56 102.87,34.14 R74.2 103.89,30.89 103.89,15.11 v104.01,14.99 104.14,14.86 104.14,5.08 v100.33,1.27 | R38.1 93.56,17.78 96.35,14.99 v101.6,14.99 | R56.1 24.26,12.7 25.27,11.68 v26.67,11.68
  Bottom 0.305: RV1.1 8.23,1.27 26.67,1.27 | 26.67,1.27 26.7,1.3 RV2.1 26.67,3.33 v26.67,11.68 | 26.67,1.27 67.69,1.27 | 67.69,1.27 v100.33,1.27 | RV4.1 67.7,1.28 67.69,1.27 | v101.6,14.99 v104.01,14.99
-12V  (via drill 0.3, 0.6)
  Top 0.305: IC1.11 11.67,19.05 C16.2 12.06,19.42 v12.06,18.54 | IC2.11 31.99,19.05 C6.2 32.37,18.47 v32.38,18.41 38.73,18.41 | C1.2 45.09,15.86 IC5.6 45.09,18.41 44.45,19.05 39.37,19.05 38.73,18.41 | IC5.1 38.73,18.41 | IC3.11 61.2,22.86 C8.2 61.59,23.23 v61.59,22.35 | IC9.4 78.75,22.23 C3.2 78.74,23.62 v79.12,24 | IC4.11 C21.2 100.95,23.73 102.23,25.02 102.23,27.43 101.73,27.94 100.71,27.94 100.33,28.32 100.33,31.6 R74.1 v97.16,33.02 | IC6.4 67.93,26.71 C13.2 v67.06,25.4 66.25,25.4 R34.1 | v65.02,18.67 64.64,19.05 C14.2 64.43,19.33 64.82,19.34 IC7.4 66.97,19.34 67.94,20.32 67.94,21.84 v67.06,22.73 | v61.09,31.75 C9.2 61.96,30.85 IC8.4 | R73.1 v91.19,33.02 83.69,33.02 82.17,34.54 80.14,34.54 v80.01,34.67 79.88,34.67 78.99,35.56 62.23,35.56 60.81,36.98 X1.8
  Top 1.016: D2.A 35.46,39.62 C23.- | C23.- 36.67,40.64 59.69,40.64 60.81,39.52 X1.8 | C23.- 36.45,39.52 37.47,38.51 v37.47,36.07
  Bottom 0.305: v65.02,18.67 64.26,18.67 62.61,20.32 62.61,21.34 v61.59,22.35 61.59,31.24 v61.09,31.75 60.81,32.03 X1.8 | v67.06,22.73 v67.06,25.4 | v97.16,33.02 v91.19,33.02 | v79.12,24 80.01,24.89 v80.01,34.67 | v12.06,18.54 12.56,19.04 32.42,19.04 32.42,19.05
  Bottom 1.016: v37.47,36.07 35.56,34.16 35.56,25.4 32.42,22.26 32.42,19.05 32.42,18.45 v32.38,18.41
-VREF
  Top 0.305: R73.2 99.21,29.21 R17.1 | R18.1 59.91,31.96 60.71,32.77 64.26,32.77 64.64,32.38 77.85,32.38 78.04,32.58 80.71,32.58 82.42,30.86 91.06,30.86 92.33,29.59 94.36,29.59 TP2.TP 95.4,30.63 R73.2 | R73.2 96.52,34.14 96.52,35.81 96.12,36.21 IC11.6 94.83,36.46 R63.1
ATT/!REL  (via drill 0.3, 0.4)
  Top 0.203: IC9.1 79.63,26.04 78.87,25.27 78.87,24.77 77.47,23.37 77.47,18.8 76.07,17.4 61.85,17.4 61.34,17.91 59.31,17.91 58.67,17.27 56.39,17.27 v56.01,17.65 | 50.55,13.84 50.8,14.1 53.21,14.1 v53.34,13.97 | 50.55,13.84 50.16,13.46 44.58,13.46 44.2,13.84 43.38,13.84 43.21,13.67 IC12.9 43.21,13.69 42.93,13.97 40.89,13.97 40.61,13.69 IC12.13 | IC14.10 56.78,12.59 55.49,11.3 51.69,11.3 50.55,12.45 50.55,13.84
  Top 0.305: IC12.13 40.61,11.02 39.96,10.37 IC12.1 38.44,7.29 35.56,10.16 35.18,10.16 24.13,10.16 23.5,10.79 20.45,10.79 17.78,13.46 | v15.75,8.26 15.75,11.43 17.78,13.46 | v8.38,7.62 R60.1 | Q1.1 18.86,21.91 17.78,20.83 17.78,13.46
  Bottom 0.305: v15.75,8.26 15.11,7.62 v8.38,7.62 | v53.34,13.97 53.85,13.97 56.01,16.13 v56.01,17.65
ATT_CV_IN
  Top 0.305: R32.1 3.39,24.98 7.62,29.21 34.29,29.21 34.29,34.92 39.12,34.92 43.05,38.86 X1.1
ATT_SHP  (via drill 0.4)
  Top 0.305: IC9.7 83.19,18.41 84.2,19.43 84.2,28.19 84.45,28.45 v84.45,28.7 | v84.45,33.91 84.05,33.91 81.76,36.2 64.64,36.2 63.35,37.49 X1.9
  Bottom 0.305: v84.45,28.7 v84.45,33.91
ATT_V
  Top 0.305: R54.2 3.98,21 IC1.1 5.29,21 6.13,21.84 R23.1
BRK_CV_IN  (via drill 0.4)
  Top 0.305: v16.76,26.29 18.41,27.94 35.56,27.94 35.56,33.66 41.4,33.66 44.58,36.83 46.23,36.83 48.11,38.71 X1.3 | v14.48,24.89 14.39,24.98 R35.1
  Bottom 0.305: v16.76,26.29 15.37,24.89 v14.48,24.89
BRK_V  (via drill 0.4)
  Top 0.305: IC1.14 11.26,21 R51.2 11.85,23.66 12.32,24.13 14.48,24.13 15.24,23.37 15.24,22.23 15.88,21.59 17.27,21.59 17.78,22.1 17.78,24.77 19.68,26.67 36.83,26.67 36.83,32.38 41.91,32.38 44.58,35.05 55.37,35.05 56.13,34.29 64.9,34.29 v65.28,33.91 | v64.14,20.83 64.32,20.64 IC7.2
  Bottom 0.305: v65.28,33.91 65.15,33.78 65.15,21.84 v64.14,20.83
DEC_CV_IN  (via drill 0.4)
  Top 0.305: v4.7,21.97 4.7,25.13 8.22,28.57 34.92,28.57 34.92,34.29 40.64,34.29 45.35,39 X1.2 | v4.7,16.13 4.7,15.66 3.64,14.61 R36.1
  Bottom 0.305: v4.7,21.97 v4.7,16.13
DEC_V
  Top 0.305: R52.2 3.98,17.1 IC1.7 5.63,17.1 6.77,15.96 R22.1
ENV_ACTIVE  (via drill 0.3)
  Top 0.203: 73.13,15.11 64.65,15.11 62.83,13.3 | v84.2,13.84 83.95,13.84 83.69,14.1 79.63,14.1 78.61,15.11 76.96,15.11 76.45,14.61 74.3,14.61 73.79,15.11 73.13,15.11 | IC13.10 73.13,15.11
  Top 0.305: R44.1 62.83,13.3 | IC9.16 86.36,26.04 | 86.36,26.04 85.6,26.04 85.09,25.53 85.09,18.8 v84.2,17.91 | TP4.TP 86.36,26.04
  Bottom 0.305: v84.2,17.91 v84.2,13.84
ENV_OUT  (via drill 0.4)
  Top 0.305: 69.85,31.37 v68.33,31.37 65.41,31.37 64.39,30.35 64.39,29.34 63.94,28.89 IC8.2 | IC6.3 69.53,27.61 69.85,27.94 69.85,31.37 | 78.07,30.01 78.07,30.39 76.71,31.75 70.23,31.75 69.85,31.37 | 78.07,30.01 78.07,25.78 R20.1 | 78.07,30.01 78.49,29.59 90.17,29.59 91.31,28.45 C25.2 | IC4.1 93.62,26.27 R2.1 93.98,27.05 93.47,27.56 C25.2 | C25.2 88.52,24.77 IC9.15
  Bottom 0.305: v68.33,31.37 68.43,31.47 X1.11
ENV_OUT_INV  (via drill 0.3)
  Top 0.305: v78.36,31.5 78.74,31.11 81.28,31.11 82.17,30.23 90.55,30.23 91.95,28.83 96.14,28.83 98.3,26.67 R1.2 99.42,26.61 IC4.14
  Bottom 0.305: v78.36,31.5 78.36,33.27 72.63,39 X1.12
EXPO_OUT
  Top 0.305: IC2.14 31.58,21 R67.2 C30.2 32.17,23.91 32.51,24.26 34.92,24.26 35.34,23.84 R9.1
GATE  (via drill 0.3)
  Top 0.203: IC14.12 55.48,14.46 56.52,15.49 74.68,15.49 v74.93,15.24 | R25.1 81.7,9.18 83.95,11.43 C24.1 83.95,12.44 82.93,13.46 v74.93,13.46
  Bottom 0.203: v74.93,15.24 v74.93,13.46
GATE_IN  (via drill 0.3)
  Top 0.305: R43.1 R28.1 50.93,31.84 v50.93,31.37
  Bottom 0.305: v50.93,31.37 50.93,36.96 X1.5
GATE_SW
  Top 0.305: R25.2 86.16,8.89 86.46,8.59 SW1.1
GND  (via drill 0.4)
  Top 0.305: Q6.2 v29.84,23.88 | IC9.5 v82.42,20.95 | IC1.3 6.33,19.7 v6.35,19.68 | IC1.5 6.33,18.4 v6.35,18.41 | IC1.12 10.51,19.68 v8.89,19.68 | IC1.10 8.9,18.4 v8.89,18.41 | IC2.3 26.43,19.7 v26.67,19.94 | IC2.5 26.43,18.4 v26.67,18.16 | IC2.12 29.32,19.7 v29.21,19.81 | IC3.3 55.87,23.51 v55.88,23.5 | IC3.12 60.03,23.5 v58.42,23.5 | IC3.10 60.03,22.23 v58.42,22.23 | IC4.5 94.98,22.21 v95,22.23 | IC4.10 98.06,22.21 v98.04,22.23 | IC9.11 88.39,19.68 v88.9,19.18 | C4.2 v88.9,20.07 | IC13.8 73.78,7.25 v73.79,7.24 | IC13.4 71.18,9.09 v70.87,9.4 70.53,9.06 IC13.3 | IC13.15 69.88,13.05 v70.23,12.7 70.53,12.99 IC13.14 | IC11.1 91.96,36.21 v91.82,36.07 | IC10.1 98.31,36.21 v98.17,36.07 | IC4.3 93.64,23.5 v95,23.5 | IC2.10 29.32,18.4 v29.21,18.29 | IC12.7 44.78,7.29 v44.83,7.24 | IC14.7 59.01,7.54 v59.05,7.49 | C18.2 52.34,12.06 v53.34,12.06 | C19.2 66.69,12.3 v66.67,12.32 | R43.2 54.06,32.89 v54.61,32.89
  other vias: 77.34,7.37 65.91,13.97 84.45,3.81 74.3,12.06 62.74,26.92 67.18,30.23 67.06,21.34 37.08,12.06 83.57,38.73 47.88,15.24 61.98,19.05 70.1,26.04 69.6,22.73 25.4,13.34 97.16,16.51 64.14,31.75 58.04,27.69 47.24,25.4 72.14,30.48 47.62,31.5 1.65,18.03 13.97,20.32 21.84,20.07 34.54,19.43 50.93,24.13 63.75,23.24 78.49,20.07 89.92,23.11 102.23,23.88 96.52,38.1 34.29,36.83 33.02,34.29 46.99,20.32 39.37,20.32 68.2,30.1
  pour Top (isolate 0.305): 0,0 105,0 105,41.5 0,41.5
  pour Bottom (isolate 0.305): 0,0 105,0 105,41.5 0,41.5
GT_BRK  (via drill 0.3, 0.4)
  Top 0.203: v75.82,15.24 76.07,15.49 78.99,15.49 79.88,14.61 85.09,14.61 85.53,14.61 85.62,14.61 SW1.3
  Top 0.305: IC7.7 73.56,20.64 R14.1 R46.2 75.56,19.68 v75.82,19.43
  Bottom 0.305: v75.82,19.43 v75.82,15.24
GT_VREF  (via drill 0.3)
  Top 0.203: IC8.7 58.36,28.89 58.8,28.45 58.8,26.16 57.66,25.02 57.66,18.67 58.04,18.29 61.75,18.29 62.01,18.03 v71.12,18.03 | v71.37,12.19 72.48,11.09 IC13.6
  Top 0.305: IC8.7 54.7,28.89 54.7,29.27 | 54.7,29.27 R12.1 | R45.2 54.7,31.43 54.7,29.27
  Bottom 0.203: v71.12,18.03 71.37,17.78 v71.37,12.19
I_ABC
  Top 0.305: IC5.16 37.21,23.39 36.2,22.38 R65.2
INT_IN  (via drill 0.3)
  Top 0.203: v53.34,15.75 53.59,15.49 55.37,15.49 55.75,15.88 79.38,15.88 80.01,15.24 94.99,15.24 SW2.2
  Top 0.305: IC3.7 53.51,20.91 R5.2 52.96,20.32 v53.98,19.3 | R57.1 99.4,11.43 SW2.2
  Bottom 0.305: v53.34,15.75 53.34,18.67 v53.98,19.3
LT_0V  (via drill 0.3)
  Top 0.203: v67.44,18.67 76.33,18.67 76.83,19.18 76.83,26.71 76.2,27.34 | v63.37,14.86 61.59,14.86 60.96,14.22 57.43,14.22 IC14.9
  Top 0.305: IC6.7 76.11,28.27 R13.1 76.2,27.34 74.26,25.4 R48.2
  Bottom 0.305: v63.37,14.86 63.63,14.86 v67.44,18.67
MULT_OUT
  Top 0.305: C26.2 52.67,27.29 R49.2 53.26,24.81 IC3.1 55.96,24.81 56.9,23.88 56.9,19.56 56.13,19.56 TP3.TP 55.5,19.43 54.61,18.54 R4.1 54.44,18.16 53.17,18.16 R3.1
N$1
  Top 1.016: D2.C 25.14,36.58 24.13,35.56 SV1.2
  Bottom 1.016: SV1.1 SV1.2
N$2
  Top 0.305: R2.2 96.1,26.45 98.39,24.16 IC4.13 100.36,24.16 101.18,24.98 R1.1
N$9
  Top 0.305: Q6.3 30.36,24.63 30.73,24.26 30.73,23.24 29.21,21.72 29.21,20.83 29.69,20.35 IC2.13 33.3,20.35 33.87,20.92 R67.1 C30.1
N$10
  Top 0.305: IC3.2 52.04,24.16 50.97,25.23 R49.1 | IC5.12 43.81,22.23 44.45,21.59 48.26,21.59 49.78,23.11 49.78,24.38 50.8,25.4 R49.1 | R49.1 50.95,25.41 C26.1
N$12
  Top 0.305: IC5.15 40.01,25.18 R69.2
N$13
  Top 0.305: IC3.6 52.04,21.56 51.22,20.74 R5.1 R3.2
N$14
  Top 0.305: RV5.1 42.55,27.3 IC5.13 42.55,22.23 41.91,21.59 R9.2
N$15
  Top 1.016: D1.A 14.61,31.11 12.7,33.02 SV1.10
  Bottom 1.016: SV1.9 SV1.10
N$16
  Top 0.305: IC5.7 IC5.8
N$18
  Top 0.203: IC14.5 56.78,9.67 58.71,11.6 R44.2
  Top 0.305: R44.2 63.88,11.6 64.26,11.21 C29.1
N$20
  Top 0.305: IC11.3 91.54,34.91 91.02,35.43 91.02,36.58 91.66,37.21 R64.1 R63.2
N$21
  Top 0.305: RV6.2 89.57,37.72 R64.2
N$23
  Top 0.305: R45.1 R18.2 58.2,30.7 59.44,29.46 59.44,25.91 58.67,25.15 58.67,24.51 59.02,24.16 IC3.13 61.41,24.16 R19.1
N$24
  Top 0.305: IC3.14 60.05,26.04 | 60.05,26.04 60.05,28.3 61.28,29.54 IC8.3 | R19.2 63.72,25.57 63.25,26.04 60.05,26.04
N$26
  Top 0.203: R41.1 67.4,4.83 70.1,4.83 71.63,3.3 RV4.2
N$27
  Top 0.203: R29.1 88.01,11.6 88.01,8 87,6.99 81.15,6.99 80.39,7.75 80.39,9.53 79.76,10.16 75.31,10.16 74.68,9.53 74.68,6.99 74.17,6.48 69.22,6.48 67.18,8.51 65.28,8.51 63.5,10.29 61.34,10.29 59.94,8.89 58.04,8.89 57.43,8.29 IC14.6
N$28
  Top 0.305: R8.2 R50.1 99.28,37.93 98.17,36.83 97.66,36.83 97.41,36.58 97.41,35.43 97.93,34.91 IC10.3
N$31
  Top 0.203: IC12.8 43.91,13.08 49.15,13.08 51.31,10.92 56.52,10.92 58.08,12.49 IC14.8
N$32
  Top 0.305: R41.2 63.03,4.45 61.98,4.45 61.34,5.08 33.02,5.08 30.48,7.62 25.4,7.62 22.48,4.7 20.45,4.7 18.8,6.35 15.49,6.35 13.55,8.29 R53.1 13.55,16.93 12.7,17.78 10.55,17.78 IC1.9 8.54,17.75 8.13,18.16 8.13,20.57 10.79,23.24 R42.2
N$33
  Top 0.305: R23.2 7.83,24.64 8.6,25.4 12.06,25.4 12.57,25.91 14.61,25.91 16.68,23.83 Q1.3
N$34
  Top 0.305: C27.2 R24.2 24.45,16.51 IC2.7 25.04,16.02 R68.1
N$35  (via drill 0.4)
  Top 0.305: R55.1 35.9,5.71 48.9,5.71 v49.15,5.97
  Bottom 0.305: v49.15,5.97 51.82,3.3 RV3.2
N$36  (via drill 0.3)
  Top 0.203: IC14.3 55.48,8.9 54.23,10.16 50.62,10.16 v50.01,10.77 | IC12.4 41.91,8.38 42.42,8.89 45.72,8.89 45.96,9.13 v45.96,9.91
  Bottom 0.203: v45.96,9.91 46.44,10.38 49.63,10.38 v50.01,10.77
N$37
  Top 0.305: IC4.9 101.21,21.56 R16.1 102.83,21.17 103.12,21.46 103.12,27.43 101.35,29.21 R17.2
N$38
  Top 0.305: C24.2 81.5,11.86 81.37,11.73 D3.A 77.38,11.73 R11.2
N$39  (via drill 0.4)
  Top 0.203: v48.9,20.95 48.9,17.78 50.93,15.75 52.2,15.75 52.83,15.11 54.61,15.11 54.83,14.89 IC14.13
  Top 0.305: v48.9,23.5 Q4.3 49.7,28.11 50.59,29 R10.1
  Bottom 0.305: v48.9,20.95 v48.9,23.5
N$40
  Top 0.305: R28.2 48.68,31.84 49.84,30.67 Q4.1
N$41
  Top 0.305: R6.2 R7.1 97.16,22.61 98.06,23.51 IC4.12
N$42
  Top 0.305: R27.1 58.42,19.6 58.42,21.08 58.9,21.56 IC3.9 60.08,21.59 63.5,21.59 65.41,23.5 69.72,23.5 70.61,24.38 75.56,24.38 | R46.1 75.56,24.38 | R20.2 75.98,24.8 75.56,24.38
N$43
  Top 0.305: 66.04,27.94 R34.2 64.98,26.89 64.77,26.67 64.77,24.64 65.28,24.13 69.47,24.13 70.74,25.4 R48.1 | 66.04,27.94 R47.2 | IC6.2 66.36,28.27 66.04,27.94
N$44
  Top 0.305: IC7.3 62.25,20 61.33,20.91 IC3.8 60.54,20.42 R27.2
N$45
  Top 0.305: IC9.14 88.73,23.5 90,24.76 C25.1 91.92,24.16 IC4.2 95.35,24.16 96.01,23.5 96.01,16.38 96.65,15.75 102.11,15.75 103.08,14.77 R37.2 R57.2 R70.2
N$46
  Top 0.305: Q5.1 IC2.8
N$48
  Top 0.203: IC3.5 51.04,22.21 49.91,21.08 49.91,17.78 51.27,16.42 54.48,16.42 | IC9.10 88.27,18.41 88.9,17.78 88.9,16.51 88.27,15.88 80.14,15.88 79.76,16.26 54.65,16.26 R4.2
  Top 0.305: R4.2 54.48,16.42
N$49
  Top 0.305: R31.1 11.2,6.16 RV1.2
N$50  (via drill 0.4)
  Top 0.305: v15.62,16.64 16.68,17.7 Q2.3 | R22.2 9.02,15.24 v9.91,16.13
  Bottom 0.305: v9.91,16.13 10.29,16.51 15.49,16.51 v15.62,16.64
N$51
  Top 0.305: IC1.13 12.67,20.35 13.55,21.23 R51.1 | R55.2 31.66,8.26 23.5,8.26 22.61,7.37 15.49,7.37 14.73,8.13 14.73,20.83 13.97,21.59 R51.1 | R51.1 13.55,23.07 R35.2
N$52  (via drill 0.4)
  Top 0.305: R21.2 11.6,12.7 v12.7,12.7 | v15.75,12.7 16.68,13.63 Q3.3
  Bottom 0.305: v12.7,12.7 v15.75,12.7
N$53
  Top 0.305: Q3.2 20.02,16.19 21.61,17.78 21.97,17.78 | 20.32,19.94 20.32,22.86 19.37,23.81 Q1.2 | Q2.2 20.26,20 20.32,19.94 | 22.73,17.78 25.01,17.78 IC2.6 | 22.73,17.78 22.01,17.06 R24.1 C27.1 R56.2 | 20.32,19.94 20.32,19.43 21.97,17.78 | 21.97,17.78 22.73,17.78
N$54
  Top 0.305: R66.2 28.16,14.61 R68.2 28.41,16.13 28.41,21.93 28.97,22.49 Q6.1
N$55
  Top 0.305: IC5.14 41.27,27.3 RV5.3
N$56
  Top 0.305: R31.2 9.31,8.38 8.42,9.27 4.32,9.27 0.64,12.95 0.64,19.68 1.3,20.35 2.54,20.35 | 2.54,20.35 IC1.2 | 2.54,20.35 1.69,21.2 R54.1 R32.2
N$57
  Top 0.305: R33.1 31.7,4.71 RV2.2
N$58
  Top 0.305: R33.2 25.78,6.35 23.24,3.81 19.94,3.81 18.29,5.46 15.24,5.46 10.67,10.03 4.99,10.03 1.69,13.34 R36.2 R52.1 1.69,16.87 2.57,17.75 IC1.6
N$59
  Top 0.305: R37.1 99.44,13.34 SW2.3
N$60
  Top 0.305: IC2.2 22.83,20.35 22.01,21.17 C28.1 22.01,22.05 22.73,22.77 | Q6.6 24.88,23.13 24.53,22.77 22.73,22.77 | R58.2 22.23,23.28 22.73,22.77
N$61  (via drill 0.4)
  Top 0.305: C28.2 24.3,21 IC2.1 25.04,21.95 v25.02,21.97 | R72.1 23.91,23.66 v23.88,23.62
  Bottom 0.305: v25.02,21.97 23.88,23.11 v23.88,23.62
N$62
  Top 0.305: R71.1 R59.2 31.28,13.97 30.85,14.4 Q5.2 30.11,14.59 29.46,15.24 29.46,17.27 29.94,17.75 IC2.9
N$63
  Top 0.305: SW2.1 100.03,9.53 R70.1
N$64
  Top 0.305: Q6.5 Q6.4 27.05,24.51 25.87,24.51 R72.2
N$67  (via drill 0.4)
  Top 0.203: R26.1 48.73,7.53 50.67,5.59 60.42,5.59 62.12,7.29 66.49,7.29 68.45,5.33 79.76,5.33 v80.01,5.08
  Bottom 0.305: v80.01,5.08 86.06,11.13 SW1.2
N$69
  Top 0.305: IC4.6 91.83,21.56 R39.1 90.51,21.17 89.79,20.45 89.79,18.58 R38.2
N$70
  Top 0.305: R29.2 91.12,14.19 SW1.6
N$73
  Top 0.305: LED1.A 1.92,7.62 R60.2
N$75
  Top 0.305: R61.2 21.15,8.89 LED2.A
N$77
  Top 0.203: IC13.11 72.48,14.52 72.26,14.73 65.53,14.73 63.25,12.45 58.8,12.45 56.9,10.54 51.05,10.54 48.9,12.7 44.96,12.7 44.32,12.06 42.8,12.06 42.55,12.32 42.55,13.02 IC12.10
N$78
  Top 0.203: R62.2 48.98,10.29 48.98,7.87 50.89,5.97 59.93,5.97 LED3.A
N$79
  Top 0.305: Q5.3 35.56,15.24 36.2,15.88 R65.1
N$80  (via drill 0.4)
  Top 0.203: IC9.6 79.38,19.68 76.7,17.02 61.47,17.02 60.96,17.53 59.69,17.53 59.05,16.89 55.75,16.89 55.5,17.14 v51.69,17.14 | R59.1 35.94,13.97 36.96,14.99 44.7,14.99 45.34,14.35 48.9,14.35 v50.04,15.49
  Top 0.305: IC9.6 82.68,19.68 83.31,20.32 83.31,22.86 82.68,23.5 IC9.3
  Bottom 0.305: v51.69,17.14 v50.04,15.49
N$83
  Top 0.305: IC5.10 IC5.9
NET_GATE
  Top 0.203: IC12.12 41.26,11.06 41.78,10.54 46.99,10.54 | IC14.1 52.37,7.54 51.56,8.38 50.8,9.14 49.78,9.14 49.4,9.53 49.4,11.56 48.64,12.32 47.28,12.32 46.99,12.03 46.99,10.54 | 46.99,10.54 46.99,9.27
  Top 0.305: R26.2 46.99,9.27
REL/!ATT  (via drill 0.3)
  Top 0.203: IC9.8 78.74,17.14 78.61,17.14 78.34,17.14 v78.11,16.91 77.83,16.64 60.58,16.64 v60.33,16.89 | IC13.9 74.08,14.22 77.85,14.22 v78.11,14.48 | IC14.11 56.13,13.97 57.02,14.86 v60.2,14.86
  Top 0.305: IC9.8 IC9.9
  Bottom 0.203: v78.11,14.48 v78.11,16.91
  Bottom 0.305: v60.33,16.89 60.33,14.99 v60.2,14.86
REL_CV_IN
  Top 0.305: X1.4 47.12,35.69 44.32,35.69 41.66,33.02 36.2,33.02 36.2,27.3 19.3,27.3 17.4,25.4 16.13,25.4 14.9,26.63 11.18,26.63 R42.1
REL_SHP  (via drill 0.4)
  Top 0.305: IC9.2 81.92,24.77 83.19,26.04 v83.19,28.7 | v83.19,36.07 82.42,36.83 66.8,36.83 65.89,37.74 X1.10
  Bottom 0.305: v83.19,28.7 v83.19,36.07
REL_V
  Top 0.305: R53.2 11.26,17.1 IC1.8 10.77,16.85 10.77,15.22 R21.1
RETRIG  (via drill 0.3)
  Top 0.203: R30.2 68.71,5.71 66.67,7.75 64.77,7.75 62.99,9.53 61.98,9.53 61.21,8.76 61.21,7.87 59.69,6.35 51.44,6.35 v50.48,7.3 | IC12.5 42.56,6.59 42.8,6.35 48.01,6.35 v48.26,6.6
  Top 0.305: R30.2 R40.1
  Bottom 0.203: v48.26,6.6 48.96,7.3 v50.48,7.3
RETRIG_SW
  Top 0.305: R30.1 87,5.71 88.9,7.62 88.9,10.16 89.87,11.13 SW1.5
SW_DEC  (via drill 0.4)
  Top 0.305: IC12.3 41.26,6.59 41.02,6.35 38.1,6.35 34.92,9.53 23.24,9.53 22.61,10.16 v19.81,10.16 18.97,10.16 18.2,9.39 R61.1 | Q2.1 18.93,18.05 19.68,18.05 v20.19,17.55
  Bottom 0.305: v20.19,17.55 20.19,10.54 v19.81,10.16
SW_REL  (via drill 0.4)
  Top 0.305: R62.1 v42.29,11.43 41.91,11.81 IC12.11 | Q3.1 18.88,13.89 21.34,11.43 24.13,11.43 24.77,10.79 v38.86,10.79
  Bottom 0.305: v42.29,11.43 39.5,11.43 v38.86,10.79
TRIG  (via drill 0.3)
  Top 0.203: R15.2 75.65,9.11 75.18,8.64 75.18,6.73 74.55,6.1 68.96,6.1 66.93,8.13 65.02,8.13 63.25,9.91 61.72,9.91 60.83,9.02 60.83,8.13 59.44,6.73 52.07,6.73 50.42,8.38 v49.66,8.38 | IC12.6 43.21,8.03 43.56,8.38 v48.26,8.38
  Top 0.305: R15.2 77.47,9.11 78.09,9.11 78.22,9.11 D3.C
  Bottom 0.203: v49.66,8.38 v48.26,8.38
TRIGS  (via drill 0.3)
  Top 0.203: IC13.12 71.83,13.01 73.13,11.71 IC13.7 73.13,7.59 72.39,6.86 69.37,6.86 67.34,8.89 65.44,8.89 63.66,10.67 61.18,10.67 59.88,9.36 v57.44,9.36 | v56.2,9.4 56.13,9.33 IC14.4
  Bottom 0.203: v57.44,9.36 56.24,9.36 v56.2,9.4
VREF  (via drill 0.4)
  Top 0.305: IC4.8 100.16,20.91 R16.2 99.69,17.57 R6.1 v99.06,16.51 | RV3.3 59.23,1.27 92.71,1.27 95.25,3.81 v95.25,12.7
  Bottom 0.305: v95.25,12.7 v99.06,16.51

### Text on the board
tPlace: FULL-SCALE V | amelia B v1.0 | (c) 2022 expert sleepers | -12V